# Altium project Shuttler_AFE.PrjPCB (part 2 of 2)

## Sheet AFE_ADC.SchDoc: Shuttler AFE
size A4; Author: G.Kasprowicz; CompanyName: WUT ISE; DrawnBy: G.Kasprowicz; Organization: WUT ISE; Address1: PW ISE; Address2: Nowowiejska 15/19 00-665 Warsaw; Address3: gkasprow@gmail.com; DocumentNumber: 2; Revision: 1.2; SheetNumber: 2; SheetTotal: 6; ModifiedBy: -; CheckedDate: -; Title2: ADC; DivGrp: WUT ISE; Designer: G.Kasprowicz; ModifiedDate: -; ProjectName: Sensor Box
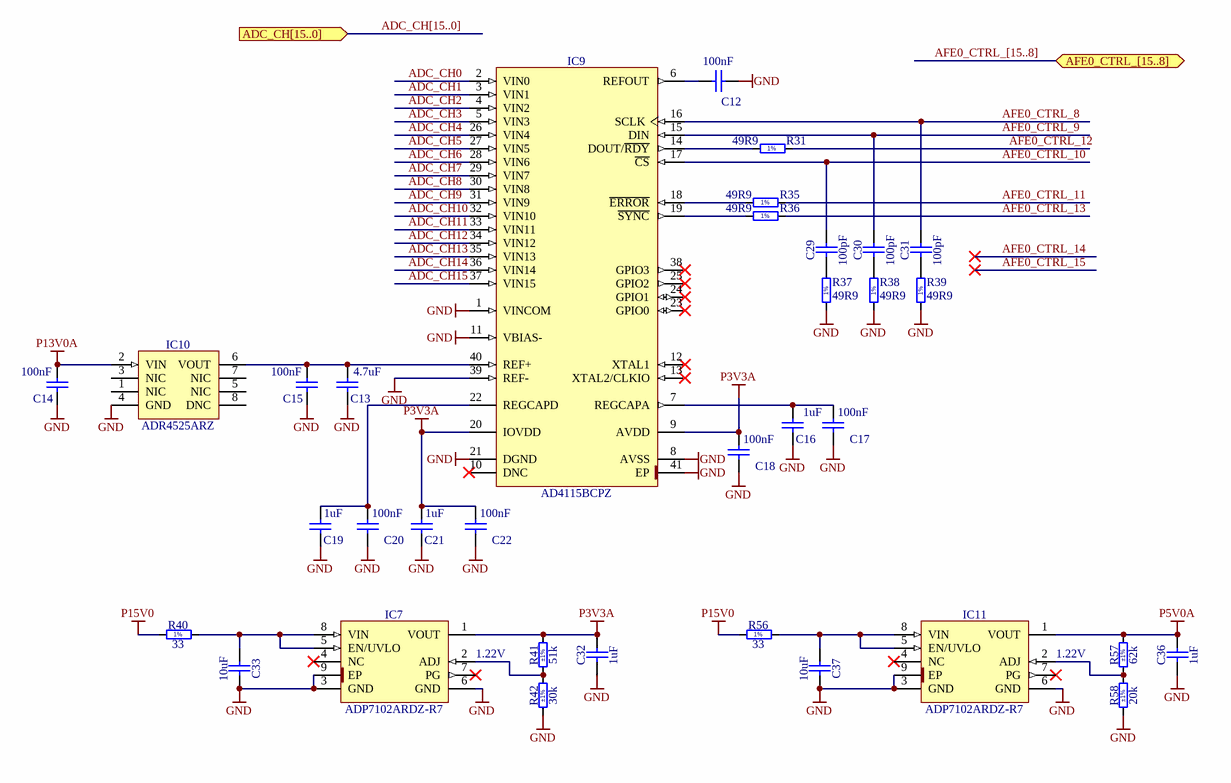
[diagram p4: AFE_ADC.SchDoc]

### Parts
(Parts that share a designator on the sheet are numbered #1, #2 ... from top to bottom, then left to right.)
C12  100nF  [CAPC1005X55N]
C13  4.7uF  [CAPC1608X90N]
C14  100nF  [CAPC1005X55N]
C15  100nF  [CAPC1005X55N]
C16  1uF  [CAPC1608X87N]
C17  100nF  [CAPC1005X55N]
C18  100nF  [CAPC1005X55N]
C19  1uF  [CAPC1608X87N]
C20  100nF  [CAPC1005X55N]
C21  1uF  [CAPC1608X87N]
C22  100nF  [CAPC1005X55N]
C29  100pF  [CAPC1005X55N]
C30  100pF  [CAPC1005X55N]
C31  100pF  [CAPC1005X55N]
C32  1uF  [CAPC1608X87N]
C33  10uF  [CAPC2012X135N]
C36  1uF  [CAPC1608X87N]
C37  10uF  [CAPC2012X135N]
IC7#2  ADP7102ARDZ-R7  [SOIC127P600X175-9N-R241X309]
IC9  AD4115BCPZ  [QFN50P600X600X100-41N-S470]
IC10  ADR4525ARZ  [SOIC127P600X175-8N]
IC11  ADP7102ARDZ-R7  [SOIC127P600X175-9N-R241X309]
R31#2  49R9  [RESC1005X40N]
R35  49R9  [RESC1005X40N]
R36  49R9  [RESC1005X40N]
R37  49R9  [RESC1005X40N]
R38  49R9  [RESC1005X40N]
R39  49R9  [RESC1005X40N]
R40  33  [RESC1005X40N]
R41  51k  Tolerance: ±1%  [RESC1005X40N]
R42  30k  Tolerance: ±1%  [RESC1005X40N]
R56  33  [RESC1005X40N]
R57  62k  Tolerance: ±1%  [RESC1005X40N]
R58  20k  Tolerance: ±1%  [RESC1005X40N]

### Ports
ADC_CH[15..0] (in), AFE0_CTRL_[15..8] (bidir)

### Nets
GND: C12.2 C13.1 C14.2 C15.2 C16.1 C17.2 C18.2 C19.1 C20.2 C21.1 C22.2 C32.1 C33.2 C36.1 C37.2 IC7#2.3(GND) IC7#2.6(GND) IC7#2.9(EP) IC9.1(VINCOM) IC9.8(AVSS) IC9.11(VBIAS-) IC9.21(DGND) IC9.39(REF-) IC9.41(EP) IC10.4(GND) IC11.3(GND) IC11.6(GND) IC11.9(EP) R37.1 R38.1 R39.1 R42.1 R58.1
P3V3A: C18.1 C21.2 C22.1 C32.2 IC7#2.1(VOUT) IC9.9(AVDD) IC9.20(IOVDD) R41.2
P5V0A: C36.2 IC11.1(VOUT) R57.2
P13V0A: C14.1 IC10.2(VIN)
P15V0: R40.1 R56.1
ADC_CH0: IC9.2(VIN0)
ADC_CH1: IC9.3(VIN1)
ADC_CH2: IC9.4(VIN2)
ADC_CH3: IC9.5(VIN3)
ADC_CH4: IC9.26(VIN4)
ADC_CH5: IC9.27(VIN5)
ADC_CH6: IC9.28(VIN6)
ADC_CH7: IC9.29(VIN7)
ADC_CH8: IC9.30(VIN8)
ADC_CH9: IC9.31(VIN9)
ADC_CH10: IC9.32(VIN10)
ADC_CH11: IC9.33(VIN11)
ADC_CH12: IC9.34(VIN12)
ADC_CH13: IC9.35(VIN13)
ADC_CH14: IC9.36(VIN14)
ADC_CH15: IC9.37(VIN15)
AFE0_CTRL_8: C31.2 IC9.16(SCLK)
AFE0_CTRL_9: C30.2 IC9.15(DIN)
AFE0_CTRL_10: C29.2 IC9.17(~{CS})
AFE0_CTRL_11: R35.2
AFE0_CTRL_12: R31#2.2
AFE0_CTRL_13: R36.2
NetC12_1: C12.1 IC9.6(REFOUT)
NetC13_2: C13.2 C15.1 IC9.40(REF+) IC10.6(VOUT)
NetC16_2: C16.2 C17.1 IC9.7(REGCAPA)
NetC19_2: C19.2 C20.1 IC9.22(REGCAPD)
NetC29_1: C29.1 R37.2
NetC30_1: C30.1 R38.2
NetC31_1: C31.1 R39.2
NetC33_1: C33.1 IC7#2.5(EN/UVLO) IC7#2.8(VIN) R40.2
NetC37_1: C37.1 IC11.5(EN/UVLO) IC11.8(VIN) R56.2
NetIC7#2_2: IC7#2.2(ADJ) R41.1 R42.2
NetIC9_14: IC9.14(DOUT/~{RDY}) R31#2.1
NetIC9_18: IC9.18(~{ERROR}) R35.1
NetIC9_19: IC9.19(~{SYNC}) R36.1
NetIC11_2: IC11.2(ADJ) R57.1 R58.2

Not connected (* = marked no-connect by the designer): IC7#2 4(NC)* 7(PG)*; IC9 10(DNC)* 12(XTAL1)* 13(XTAL2/CLKIO)* 23(GPIO0)* 24(GPIO1)* 25(GPIO2)* 38(GPIO3)*; IC10 1(NIC) 3(NIC) 5(NIC) 7(NIC) 8(DNC); IC11 4(NC)* 7(PG)*

### Buses and harness runs
bus ADC_CH[15..0] = port ADC_CH[15..0]
bus AFE0_CTRL_[15..8] = port AFE0_CTRL_[15..8]

### Notes on the sheet
- 1.22V
- Project/Equipment
- Document
- Designer
- Drawn by
- Check.by
- Copyright WUT ISE 2020.
  This documentation describes Open Hardware and is licensed under the CERN OHL v.1.2. You may redistribute and modify this documentation under the terms of the CERN OHL v.1.2. (http://ohwr.org/CERNOHL). This documentation is distributed WITHOUT ANY EXPRESS OR IMPLIED WARRANTY, INCLUDING OF MERCHANTABILITY, SATISFACTORY QUALITY AND FITNESS FOR A PARTICULAR PURPOSE. Please see the CERN OHL v.1.2 for applicable conditions.
- Contact
- File
- Last Mod.
- Print Date
- Sheet
- Size
- A3
- of
- Rev
- (in symbol R0402_33R_1%_0.0625W_100PPM) 1%
- (in symbol R0402_49R9_1%_0.0625W_100PPM) 1%

### Library data of the parts
C12 C14 C15 C17 C18 C20 C22 = CC0402_100NF_16V_10%_X5R: Non-polarised capacitor; Part Description: SMD Multilayer Chip Ceramic Capacitor; Manufacturer: GENERIC; Manufacturer1 Part Number: GRM155R61C104KA88D; Voltage: 16V; TC: X5R; Tolerance: ±10%; Part Number: CC0402_100NF_16V_10%_X5R; Component Kind: Standard; Component Type: Standard; Pin Count: 2; Value: 100nF; Status: None; Manufacturer Part Number: CC0402_100NF_16V_10%_X5R; Case: 0402; Mounted: Yes; Socket: No; SMD: Yes; Sense: No; Manufacturer1 Example: MURATA; Manufacturer1 ComponentHeight: 0.55mm; HelpURL: \\cern.ch\dfs\Applications\Altium\Datasheets\CC0402_X5R_MURATA_GRM.pdf; Author: CERN DEM JLC; CreateDate: 10.12.2013; LatestRevisionDate: 10.12.2013
C13 = CC0603_4.7UF_25V_10%_X5R: Non-polarised capacitor; Part Description: SMD Multilayer Chip Ceramic Capacitor; Manufacturer: GENERIC; Manufacturer1 Part Number: GRM188R61E475KE11D; Voltage: 25V; TC: X5R; Tolerance: ±10%; Part Number: CC0603_4.7UF_25V_10%_X5R; Component Kind: Standard; Component Type: Standard; Pin Count: 2; Value: 4.7uF; Status: None; Manufacturer Part Number: CC0603_4.7UF_25V_10%_X5R; Case: 0603; Mounted: Yes; Socket: No; SMD: Yes; Sense: No; Manufacturer1 Example: MURATA; Manufacturer1 ComponentHeight: 0.95mm; HelpURL: \\cern.ch\dfs\Applications\Altium\Datasheets\CC0603_MURATA_GRM188R61E475KE11D.pdf; Author: CERN DEM JLC; CreateDate: 10.11.2014; LatestRevisionDate: 10.11.2014
C16 C19 C21 = CC0603_1UF_16V_10%_X7R: Non-polarised capacitor; Part Description: SMD Multilayer Chip Ceramic Capacitor; Manufacturer: GENERIC; Manufacturer1 Part Number: 223878615663; Voltage: 16V; TC: X7R; Tolerance: ±10%; Part Number: CC0603_1UF_16V_10%_X7R; Component Kind: Standard; Component Type: Standard; Pin Count: 2; Value: 1uF; Status: None; Manufacturer Part Number: CC0603_1UF_16V_10%_X7R; Case: 0603; Mounted: Yes; Socket: No; SMD: Yes; Sense: No; Manufacturer1 Example: YAGEO PHYCOMP; Manufacturer1 ComponentHeight: 0.9mm; HelpURL: \\cern.ch\dfs\Applications\Altium\Datasheets\CC0603_X7R_PHYCOMP.pdf; Author: CERN DEM JLC; CreateDate: 03.12.2007; LatestRevisionDate: 17.04.2015
C29-C31 = CC0402_100PF_50V_5%_C0G: Non-polarised capacitor; Part Description: SMD Multilayer Chip Ceramic Capacitor; Manufacturer: GENERIC; Manufacturer1 Part Number: C0402C101J5GACTU; Voltage: 50V; TC: C0G/NP0; Tolerance: ±5%; Part Number: CC0402_100PF_50V_5%_C0G; Component Kind: Standard; Component Type: Standard; Pin Count: 2; Value: 100pF; Status: Preferred; Manufacturer Part Number: CC0402_100PF_50V_5%_C0G; Case: 0402; Mounted: Yes; Socket: No; SMD: Yes; Sense: No; Manufacturer1 Example: KEMET; Manufacturer1 ComponentHeight: 0.55mm; HelpURL: \\cern.ch\dfs\Applications\Altium\Datasheets\CC0402_C0G_KEMET_(Commercial Grade).pdf; Author: CERN DEM JLC; CreateDate: 03.12.2007; LatestRevisionDate: 22.04.2015
C32 C36 = CC0603_1UF_25V_10%_X7R: Non-polarised capacitor; Part Description: SMD Multilayer Chip Ceramic Capacitor; Manufacturer: GENERIC; Manufacturer1 Part Number: GRM188R71E105KA12D; Voltage: 25V; TC: X7R; Tolerance: ±10%; Part Number: CC0603_1UF_25V_10%_X7R; Component Kind: Standard; Component Type: Standard; Pin Count: 2; Value: 1uF; Status: None; Manufacturer Part Number: CC0603_1UF_25V_10%_X7R; Case: 0603; Mounted: Yes; Socket: No; SMD: Yes; Sense: No; Manufacturer1 Example: MURATA; Manufacturer1 ComponentHeight: 0.9mm; HelpURL: \\cern.ch\dfs\Applications\Altium\Datasheets\CC0603_X7R_MURATA.pdf; Author: CERN DEM JLC; CreateDate: 18/01/2011; LatestRevisionDate: 18/01/2011
C33 C37 = CC0805_10UF_16V_10%_X5R: Non-polarised capacitor; Part Description: SMD Multilayer Chip Ceramic Capacitor; Manufacturer: GENERIC; Manufacturer1 Part Number: C0805C106K4PAC; Voltage: 16V; TC: X5R; Tolerance: ±10%; Part Number: CC0805_10UF_16V_10%_X5R; Component Kind: Standard; Component Type: Standard; Pin Count: 2; Value: 10uF; Status: Preferred; Manufacturer Part Number: CC0805_10UF_16V_10%_X5R; Case: 0805; Mounted: Yes; Socket: No; SMD: Yes; Manufacturer1 Example: KEMET; Manufacturer1 ComponentHeight: 1.4mm; HelpURL: \\cern.ch\dfs\Applications\Altium\Datasheets\CC1206_X5R_KEMET.pdf; Author: CERN DEM JLC; CreateDate: 03.12.2007; LatestRevisionDate: 03.12.2007; Sense: No
IC7#2 IC11 = ADP7102ARDZ-R7: 1.22V to 19V, 300mA, Low Noise, CMOS LDO Adjustable Linear Regulator; Manufacturer: ANALOG DEVICES; PressFit: No; Bonding: No; Part Number: ADP7102ARDZ-R7; Component Kind: Standard; Component Type: Standard; Device: ADP7102ARDZ-R7; PackageDescription: SOIC 8, Pitch 1.27mm - Body 3.9x4.9mm, (w/thermal tab 2.41mm X 3.098mm), IPC Medium Density; Part Description: 1.22V to 19V, 300mA, Low Noise, CMOS LDO Adjustable Linear Regulator; Manufacturer Part Number: ADP7102ARDZ-R7; Pin Count: 8; Case: SOIC8; Mounted: Yes; Socket: No; SMD: Yes; Sense: No; ComponentHeight: 1.75mm; HelpURL: \\cern.ch\dfs\Applications\Altium\Datasheets\ADP7102ARDZ-R7.pdf; Author: CERN DEM JLC; CreateDate: 16.06.2014; LatestRevisionDate: 16.06.2014
IC9 = AD4115BCPZ: Single-Supply, Multichannel, 125kSPS, 24-Bit, Sigma-Delta ADC with ±10V Inputs; Manufacturer: ANALOG DEVICES; PressFit: No; Bonding: No; Part Number: AD4115BCPZ; Component Kind: Standard; Component Type: Standard; Device: AD4115BCPZ; PackageDescription: QFN, 0.50mm Pitch, Square; 40 Pin, 6.00mm L X 6.00mm W X 1.00mm H body (w/Thermal Tab 4.70 x 4.70mm), IPC Medium Density; Part Description: Single-Supply, Multichannel, 125kSPS, 24-Bit, Sigma-Delta ADC with ±10V Inputs; Manufacturer Part Number: AD4115BCPZ; Pin Count: 41; Case: QFN40; Mounted: Yes; Socket: No; SMD: Yes; Sense: No; ComponentHeight: 1.0mm; Author: CERN DEM BC; HelpURL: \\cern.ch\dfs\Applications\Altium\Datasheets\AD4115BCPZ.pdf; CreateDate: 30.10.2020; LatestRevisionDate: 30.10.2020
IC10 = ADR4525ARZ: 2.5V Output, 1mV ±0.04% Accuracy, 4ppm/°C Ultralow Noise, High Accuracy Voltage References; Manufacturer: ANALOG DEVICES; PressFit: No; Bonding: No; Part Number: ADR4525ARZ; Component Kind: Standard; Component Type: Standard; Device: ADR4525ARZ; PackageDescription: SOIC 8, Pitch 1.27mm, Body 4x5mm, IPC Medium Density; Part Description: 2.5V Output, 1mV ±0.04% Accuracy, 4ppm/°C Ultralow Noise, High Accuracy Voltage References; Manufacturer Part Number: ADR4525ARZ; Pin Count: 8; Case: SOIC8; Mounted: Yes; Socket: No; SMD: Yes; Sense: No; ComponentHeight: 1.75mm; HelpURL: \\cern.ch\dfs\Applications\Altium\Datasheets\ADR4525ARZ.pdf; Author: CERN DEM BC; CreateDate: 19.06.2020; LatestRevisionDate: 19.06.2020
R31#2 R35-R39 = R0402_49R9_1%_0.0625W_100PPM: Resistor - 1%; Part Description: General Purpose Thick Film Chip Resistor; Manufacturer: GENERIC; Manufacturer1 Part Number: 232270674999L or RC0402FR-0749R9L; TC: ±100ppm/°C; PressFit: No; Part Number: R0402_49R9_1%_0.0625W_100PPM; Component Kind: Standard; Component Type: Standard; Pin Count: 2; Value: 49R9; Status: Not Recommended; Power: 0.0625W; Tolerance: ±1%; Manufacturer Part Number: R0402_49R9_1%_0.0625W_100PPM; Case: 0402; Mounted: Yes; Sense: No; Socket: No; SMD: Yes; Manufacturer1 Example: YAGEO PHYCOMP; Manufacturer1 ComponentHeight: 0.4mm; HelpURL: \\cern.ch\dfs\Applications\Altium\Datasheets\R0402_Phycomp_RC0402.pdf; Author: CERN DEM JLC; CreateDate: 24.10.2012; LatestRevisionDate: 24.10.2012
R40 R56 = R0402_33R_1%_0.0625W_100PPM: Resistor - 1%; Part Description: General Purpose Thick Film Chip Resistor; Manufacturer: GENERIC; Manufacturer1 Part Number: 232270673309L; TC: ±100ppm/°C; PressFit: No; Part Number: R0402_33R_1%_0.0625W_100PPM; Component Kind: Standard; Component Type: Standard; Pin Count: 2; Value: 33; Status: Not Recommended; Power: 0.0625W; Tolerance: ±1%; Manufacturer Part Number: R0402_33R_1%_0.0625W_100PPM; Case: 0402; Mounted: Yes; Sense: No; Socket: No; SMD: Yes; Manufacturer1 Example: YAGEO PHYCOMP; Manufacturer1 ComponentHeight: 0.4mm; HelpURL: \\cern.ch\dfs\Applications\Altium\Datasheets\R0402_Phycomp_RC0402.pdf; Author: CERN DEM JLC; CreateDate: 03/12/2007; LatestRevisionDate: 17/10/2012
R41 = R0402_51K_1%_0.0625W_100PPM: Resistor - 1%; Part Description: General Purpose Thick Film Chip Resistor; Manufacturer: GENERIC; Manufacturer1 Part Number: 232270674703L; TC: ±100ppm/°C; PressFit: No; Part Number: R0402_51K_1%_0.0625W_100PPM; Component Kind: Standard; Component Type: Standard; Pin Count: 2; Value: 51k; Status: Not Recommended; Power: 0.0625W; Manufacturer Part Number: R0402_51K_1%_0.0625W_100PPM; Case: 0402; Mounted: Yes; Sense: No; Socket: No; SMD: Yes; Manufacturer1 Example: YAGEO PHYCOMP; Manufacturer1 ComponentHeight: 0.4mm; HelpURL: \\cern.ch\dfs\Applications\Altium\Datasheets\R0402_Phycomp_RC0402.pdf; Author: CERN DEM JLC; CreateDate: 03.12.2007; LatestRevisionDate: 17.10.2012
R42 = R0402_30K_1%_0.0625W_100PPM: Resistor - 1%; Part Description: General Purpose Thick Film Chip Resistor; Manufacturer: GENERIC; Manufacturer1 Part Number: 232270673003L; TC: ±100ppm/°C; PressFit: No; Part Number: R0402_30K_1%_0.0625W_100PPM; Component Kind: Standard; Component Type: Standard; Pin Count: 2; Value: 30k; Status: Not Recommended; Power: 0.0625W; Manufacturer Part Number: R0402_30K_1%_0.0625W_100PPM; Case: 0402; Mounted: Yes; Sense: No; Socket: No; SMD: Yes; Manufacturer1 Example: YAGEO PHYCOMP; Manufacturer1 ComponentHeight: 0.4mm; HelpURL: \\cern.ch\dfs\Applications\Altium\Datasheets\R0402_Phycomp_RC0402.pdf; Author: CERN DEM JLC; CreateDate: 03.12.2007; LatestRevisionDate: 17.10.2012
R57 = R0402_62K_1%_0.0625W_100PPM: Resistor - 1%; Part Description: General Purpose Thick Film Chip Resistor; Manufacturer: GENERIC; Manufacturer1 Part Number: 232270676203L; TC: ±100ppm/°C; PressFit: No; Part Number: R0402_62K_1%_0.0625W_100PPM; Component Kind: Standard; Component Type: Standard; Pin Count: 2; Value: 62k; Status: Not Recommended; Power: 0.0625W; Manufacturer Part Number: R0402_62K_1%_0.0625W_100PPM; Case: 0402; Mounted: Yes; Sense: No; Socket: No; SMD: Yes; Manufacturer1 Example: YAGEO PHYCOMP; Manufacturer1 ComponentHeight: 0.4mm; HelpURL: \\cern.ch\dfs\Applications\Altium\Datasheets\R0402_Phycomp_RC0402.pdf; Author: CERN DEM JLC; CreateDate: 03.12.2007; LatestRevisionDate: 17.10.2012
R58 = R0402_20K_1%_0.0625W_100PPM: Resistor - 1%; Part Description: General Purpose Thick Film Chip Resistor; Manufacturer: GENERIC; Manufacturer1 Part Number: 232270672003L; TC: ±100ppm/°C; PressFit: No; Part Number: R0402_20K_1%_0.0625W_100PPM; Component Kind: Standard; Component Type: Standard; Pin Count: 2; Value: 20k; Status: Not Recommended; Power: 0.0625W; Manufacturer Part Number: R0402_20K_1%_0.0625W_100PPM; Case: 0402; Mounted: Yes; Sense: No; Socket: No; SMD: Yes; Manufacturer1 Example: YAGEO PHYCOMP; Manufacturer1 ComponentHeight: 0.4mm; HelpURL: \\cern.ch\dfs\Applications\Altium\Datasheets\R0402_Phycomp_RC0402.pdf; Author: CERN DEM JLC; CreateDate: 03.12.2007; LatestRevisionDate: 17.10.2012

## Sheet AFE_Supply.SchDoc: Shuttler AFE
size A4; Author: G.Kasprowicz; CompanyName: WUT ISE; DrawnBy: G.Kasprowicz; Organization: WUT ISE; Address1: PW ISE; Address2: Nowowiejska 15/19 00-665 Warsaw; Address3: gkasprow@gmail.com; DocumentNumber: 4; Revision: 1.2; SheetNumber: 4; SheetTotal: 6; ModifiedBy: -; CheckedDate: -; Title2: Power supply; DivGrp: WUT ISE; Designer: G.Kasprowicz; ModifiedDate: -; ProjectName: Sensor Box
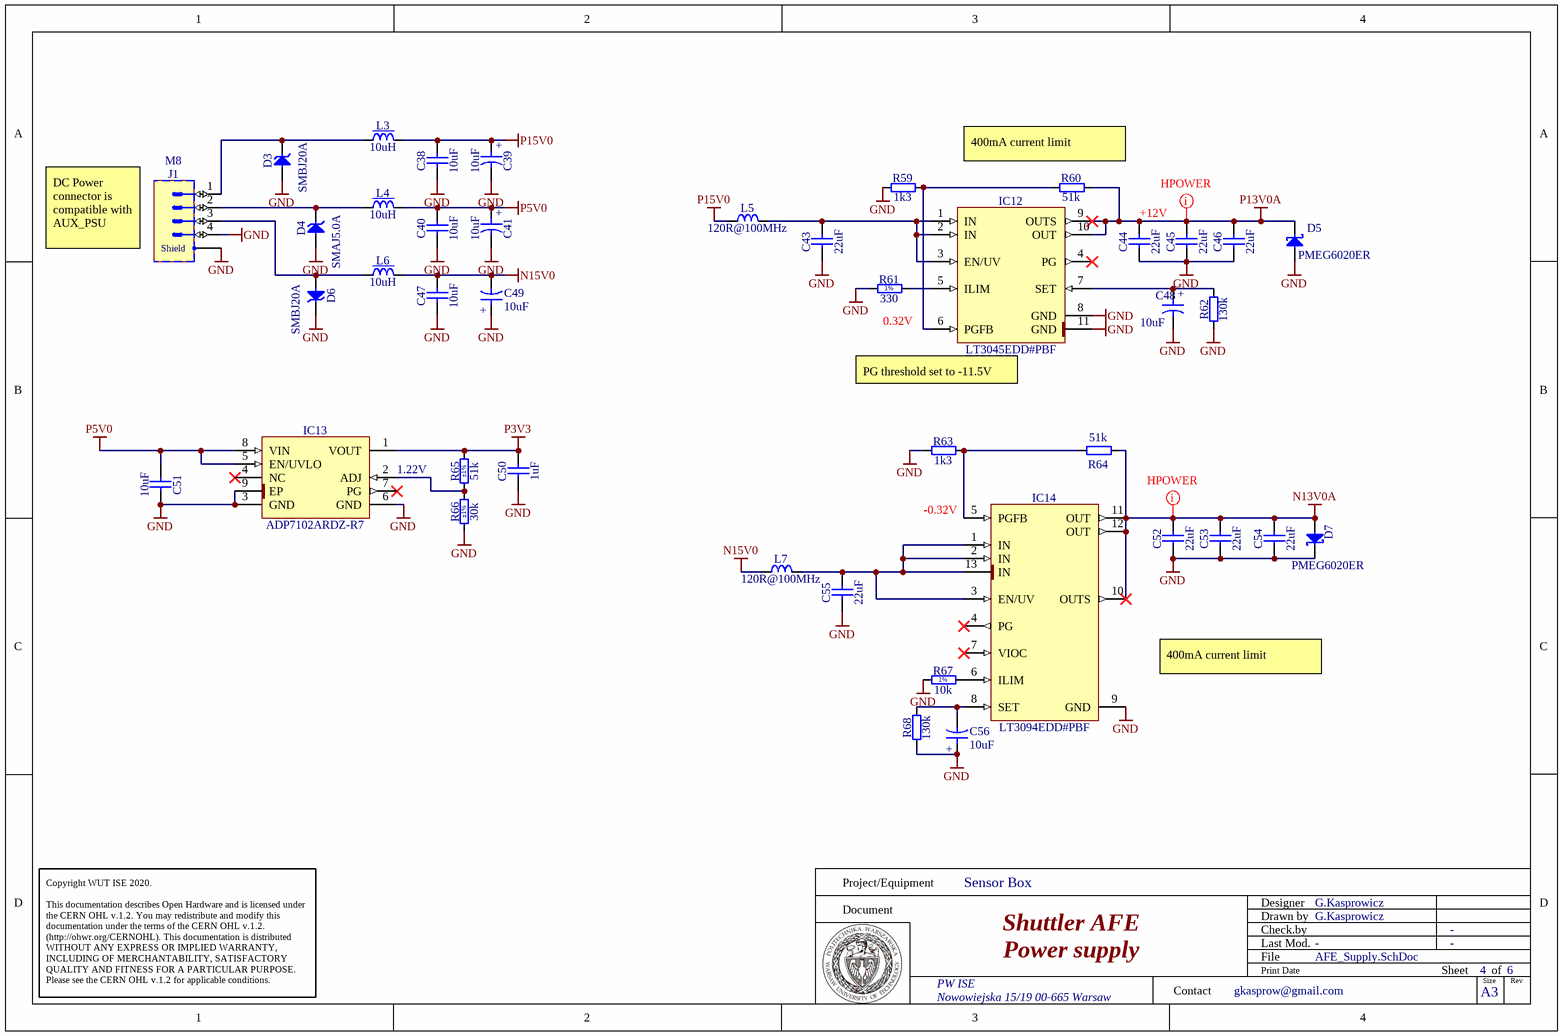
[diagram p5: AFE_Supply.SchDoc]

### Parts
C38  10uF  [CAPC2012X95N]
C39  10uF  [CAPMP3216X180N]
C40  10uF  [CAPC2012X95N]
C41  10uF  [CAPMP3216X180N]
C43  22uF  [CAPC2012X135N]
C44  22uF  [CAPC2012X135N]
C45  22uF  [CAPC2012X135N]
C46  22uF  [CAPC2012X135N]
C47  10uF  [CAPC2012X95N]
C48  10uF  [CAPMP3216X180N]
C49  10uF  [CAPMP3216X180N]
C50  1uF  [CAPC1608X87N]
C51  10uF  [CAPC2012X135N]
C52  22uF  [CAPC2012X135N]
C53  22uF  [CAPC2012X135N]
C54  22uF  [CAPC2012X135N]
C55  22uF  [CAPC2012X135N]
C56  10uF  [CAPMP3216X180N]
D3  SMBJ20A  [DIOM5336X265N]
D4  SMAJ5.0A  [DIOM5226X262N]
D5  PMEG6020ER  [SODFL3517X110N]
D6  SMBJ20A  [DIOM5336X265N]
D7  PMEG6020ER  [SODFL3517X110N]
IC12  LT3045EDD#PBF  [SON50P300X300X80-11N-R175X248]
IC13  ADP7102ARDZ-R7  [SOIC127P600X175-9N-R241X309]
IC14  LT3094EDD#PBF  [SON45P300X300X80-13N-R175X248]
J1  M8  [AMPHENOL_M8AS-04PMMR-SF8001]
L3  10uH  [IND_MURATA_LQW32FT_0H]
L4  10uH  [IND_MURATA_LQW32FT_0H]
L5  120R@100MHz  [INDC1608X95N]
L6  10uH  [IND_MURATA_LQW32FT_0H]
L7  120R@100MHz  [INDC1608X95N]
R59  1k3  [RESC1005X40N]
R60  51k  [RESC1005X40N]
R61  330  [RESC1005X40N]
R62  130k  [RESC1608X55N]
R63  1k3  [RESC1005X40N]
R64  51k  [RESC1005X40N]
R65  51k  Tolerance: ±1%  [RESC1005X40N]
R66  30k  Tolerance: ±1%  [RESC1005X40N]
R67  10k  [RESC1005X40N]
R68  130k  [RESC1608X55N]

### Nets
GND: C38.1 C39.2 C40.1 C41.2 C43.1 C44.1 C45.1 C46.1 C47.1 C48.2 C49.1 C50.1 C51.2 C52.1 C53.1 C54.1 C55.1 C56.1 D3.2(A) D4.2(A) D5.2(A) D6.1(C) D7.1(C) IC12.8(GND) IC12.11(GND) IC13.3(GND) IC13.6(GND) IC13.9(EP) IC14.9(GND) J1.4 J1.SHIELD R59.1 R61.1 R62.1 R63.1 R66.1 R67.1 R68.1
N13V0A: C52.2 C53.2 C54.2 D7.2(A) IC14.10(OUTS) IC14.11(OUT) IC14.12(OUT) R64.1
N15V0: C47.2 C49.2 L6.2 L7.1
P3V3: C50.2 IC13.1(VOUT) R65.2
P5V0: C40.2 C41.1 C51.1 IC13.5(EN/UVLO) IC13.8(VIN) L4.2
P13V0A: C44.2 C45.2 C46.2 D5.1(C) IC12.9(OUTS) IC12.10(OUT) R60.2
P15V0: C38.2 C39.1 L3.2 L5.1
NetC43_2: C43.2 IC12.1(IN) IC12.2(IN) IC12.3(EN/UV) L5.2
NetC48_1: C48.1 IC12.7(SET) R62.2
NetC55_2: C55.2 IC14.1(IN) IC14.2(IN) IC14.3(EN/UV) IC14.13(IN) L7.2
NetC56_2: C56.2 IC14.8(SET) R68.2
NetD3_1: D3.1(C) J1.1 L3.1
NetD4_1: D4.1(C) J1.2 L4.1
NetD6_2: D6.2(A) J1.3 L6.1
NetIC12_5: IC12.5(ILIM) R61.2
NetIC12_6: IC12.6(PGFB) R59.2 R60.1
NetIC13_2: IC13.2(ADJ) R65.1 R66.2
NetIC14_5: IC14.5(PGFB) R63.2 R64.2
NetIC14_6: IC14.6(ILIM) R67.2

Not connected (* = marked no-connect by the designer): IC12 4(PG)*; IC13 4(NC)* 7(PG)*; IC14 4(PG)* 7(VIOC)*

### Layout directives
net class Hpower: N13V0A, P13V0A

### Notes on the sheet
- (near R60) 400mA current limit
- DC Power connector is compatible with AUX_PSU
- (near C44) +12V
- (near IC12) PG threshold set to -11.5V
- 0.32V
- 1.22V
- (near IC14) -0.32V
- 400mA current limit
- Project/Equipment
- Document
- Designer
- Drawn by
- Check.by
- Copyright WUT ISE 2020.
  This documentation describes Open Hardware and is licensed under the CERN OHL v.1.2. You may redistribute and modify this documentation under the terms of the CERN OHL v.1.2. (http://ohwr.org/CERNOHL). This documentation is distributed WITHOUT ANY EXPRESS OR IMPLIED WARRANTY, INCLUDING OF MERCHANTABILITY, SATISFACTORY QUALITY AND FITNESS FOR A PARTICULAR PURPOSE. Please see the CERN OHL v.1.2 for applicable conditions.
- Contact
- File
- Last Mod.
- Print Date
- Sheet
- Size
- A3
- of
- Rev
- (in symbol AMPHENOL_M8AS-04PMMR-SF8001) Shield
- (in symbol CTE3216-18_10UF_16V_20%_AVX_TCJ) +
- (in symbol R0402_10k_1%_0.0625W_100PPM) 1%
- (in symbol R0402_330R_1%_0.0625W_100PPM) 1%

### Library data of the parts
C38 C40 C47 = CC0805_10UF_25V_10%_X5R: Non-polarised capacitor; Part Description: SMD Multilayer Chip Ceramic Capacitor; Manufacturer: GENERIC; Manufacturer1 Part Number: GRM219R61E106KA12D; Voltage: 25V; TC: X5R; Tolerance: ±10%; Part Number: CC0805_10UF_25V_10%_X5R; Component Kind: Standard; Component Type: Standard; Pin Count: 2; Value: 10uF; Status: Preferred; Manufacturer Part Number: CC0805_10UF_25V_10%_X5R; Case: 0805; Mounted: Yes; Socket: No; SMD: Yes; Sense: No; Manufacturer1 Example: MURATA; Manufacturer1 ComponentHeight: 0.95mm; HelpURL: \\cern.ch\dfs\Applications\Altium\Datasheets\CC0805_X5R_MURATA_GRM.pdf; Author: CERN DEM JLC; CreateDate: 25.10.2012; LatestRevisionDate: 06.09.2016
C39 C41 C48 C49 C56 = CTE3216-18_10UF_16V_20%_AVX_TCJ: Polarised capacitor; Part Description: ESR 0R200 Tantalum Solid Electrolytic Chip Capacitor with Conductive Polymer Electrode; Manufacturer: AVX; Manufacturer Part Number: TCJA106M016R0200 or  or TR3A106K016C1700; Voltage: 16V; Tolerance: ±20%; Part Number: CTE3216-18_10UF_16V_20%_AVX_TCJ; Component Kind: Standard; Component Type: Standard; Pin Count: 2; Value: 10uF; Status: Preferred; Case: A; Mounted: Yes; Socket: No; SMD: Yes; Sense: No; ComponentHeight: 1.8mm; HelpURL: \\cern.ch\dfs\Applications\Altium\Datasheets\CTE_AVX_TCJ.pdf; Author: CERN DEM JLC; CreateDate: 29.03.2012; LatestRevisionDate: 29.03.2012
C43-C46 C52-C55 = CC0805_22UF_16V_10%_X5R: Non-polarised capacitor; Part Description: SMD Multilayer Chip Ceramic Capacitor; Manufacturer: GENERIC; Manufacturer1 Part Number: C2012X5R1C226KT; Voltage: 16V; TC: X5R; Tolerance: ±10%; Part Number: CC0805_22UF_16V_10%_X5R; Component Kind: Standard; Component Type: Standard; Pin Count: 2; Value: 22uF; Status: Preferred; Manufacturer Part Number: CC0805_22UF_16V_10%_X5R; Case: 0805; Mounted: Yes; Socket: No; SMD: Yes; Sense: No; Manufacturer1 Example: TDK; Manufacturer1 ComponentHeight: 1.35mm; HelpURL: \\cern.ch\dfs\Applications\Altium\Datasheets\CC0805_X5R_TDK_C.pdf; Author: CERN DEM JLC; CreateDate: 25.10.2012; LatestRevisionDate: 25.10.2012
C50 = CC0603_1UF_25V_10%_X7R: as C32 on sheet AFE_ADC; Part Number: CC0603_1UF_25V_10%_X7R; Component Kind: Standard; Component Type: Standard; Pin Count: 2; Value: 1uF; Status: None; Manufacturer Part Number: CC0603_1UF_25V_10%_X7R; Case: 0603; Mounted: Yes; Socket: No; SMD: Yes; Sense: No; Manufacturer1 Example: MURATA; Manufacturer1 ComponentHeight: 0.9mm; HelpURL: \\cern.ch\dfs\Applications\Altium\Datasheets\CC0603_X7R_MURATA.pdf; Author: CERN DEM JLC; CreateDate: 18/01/2011; LatestRevisionDate: 18/01/2011
C51 = CC0805_10UF_16V_10%_X5R: as C33 on sheet AFE_ADC; Part Number: CC0805_10UF_16V_10%_X5R; Component Kind: Standard; Component Type: Standard; Pin Count: 2; Value: 10uF; Status: Preferred; Manufacturer Part Number: CC0805_10UF_16V_10%_X5R; Case: 0805; Mounted: Yes; Socket: No; SMD: Yes; Manufacturer1 Example: KEMET; Manufacturer1 ComponentHeight: 1.4mm; HelpURL: \\cern.ch\dfs\Applications\Altium\Datasheets\CC1206_X5R_KEMET.pdf; Author: CERN DEM JLC; CreateDate: 03.12.2007; LatestRevisionDate: 03.12.2007; Sense: No
D3 D6 = SMBJ20A: Transient Voltage Suppressor Diode (Uni-Directional); Part Description: Uni-Directional Transient Voltage Suppressor Diode; Manufacturer: FAIRCHILD SEMICONDUCTOR; Voltage: 20V; Power: 600W; PressFit: No; Bonding: No; Part Number: SMBJ20A; Component Kind: Standard; Component Type: Standard; Device: SMBJ20A; PackageDescription: DO-214-AA/SMB Diode, Molded Body; 5.34mm L X 3.625mm W X 2.65mm H, IPC Medium Density; Manufacturer Part Number: SMBJ20A; Pin Count: 2; Case: DO-214AA; Mounted: Yes; Socket: No; SMD: Yes; Sense: No; ComponentHeight: 2.65mm; HelpURL: \\cern.ch\dfs\Applications\Altium\Datasheets\SMBJ.pdf; Author: CERN DEM JLC; CreateDate: 12.05.2009; LatestRevisionDate: 19.12.2011
D4 = SMAJ5.0A: Transient Voltage Suppressor Diode (Uni-Directional); Part Description: Surface Mount Uni-directional Transient Voltage Suppressor Diode; Manufacturer: BOURNS; Voltage: 5V; Power: 400W; PressFit: No; Bonding: No; Part Number: SMAJ5.0A; Component Kind: Standard; Component Type: Standard; Device: SMAJ5.0A; PackageDescription: DO-214-AC/SMA Diode, Molded Body; 5.21mm L X 2.605mm W X 2.62mm H, IPC Medium Density; Manufacturer Part Number: SMAJ5.0A; Pin Count: 2; Case: DO-214AC; Mounted: Yes; Socket: No; SMD: Yes; Sense: No; ComponentHeight: 2.62mm; HelpURL: \\cern.ch\dfs\Applications\Altium\Datasheets\SMAJ5.0A.pdf; Author: CERN DEM MR; CreateDate: 14.07.2016; LatestRevisionDate: 14.07.2016
D5 D7 = PMEG6020ER: Schottky Diode; Part Description: MEGA Schottky Barrier Rectifier; Manufacturer: NXP SEMICONDUCTORS; Voltage: 60V; Power: 2A; PressFit: No; Bonding: No; Part Number: PMEG6020ER; Component Kind: Standard; Component Type: Standard; Device: PMEG6020ER; PackageDescription: SODFL Diode (SOD123W); 2.60mm W X 1.70mm L X 1.10mm H body, IPC Medium Density; Manufacturer Part Number: PMEG6020ER; Pin Count: 2; Case: SOD123; Mounted: Yes; Socket: No; SMD: Yes; Sense: No; ComponentHeight: 0.65mm; HelpURL: \\cern.ch\dfs\Applications\Altium\Datasheets\PMEG6020ER.pdf; Author: CERN DEM JMW; CreateDate: 19.06.2014; LatestRevisionDate: 19.06.2014
IC12 = LT3045EDD#PBF: 20V, 500mA, Ultralow Noise, Ultrahigh PSRR Linear Regulator; Manufacturer: LINEAR TECHNOLOGY; PressFit: No; Bonding: No; Part Number: LT3045EDD#PBF; Component Kind: Standard; Component Type: Standard; Device: LT3045EDD#PBF; PackageDescription: SON, 0.50mm Pitch; 10-pin, 3.00mm W  X 3.00mm L X 0.80mm H Body, (w/thermal tab 1.75 X 2.48 mm), IPC Medium Density; Part Description: 20V, 500mA, Ultralow Noise, Ultrahigh PSRR Linear Regulator; Manufacturer Part Number: LT3045EDD#PBF; Pin Count: 11; Case: SON10; Mounted: Yes; Socket: No; SMD: Yes; Sense: No; ComponentHeight: 0.8mm; HelpURL: \\cern.ch\dfs\Applications\Altium\Datasheets\LT3045EDD#PBF.pdf; Author: CERN DEM JLC; CreateDate: 07.12.2016; LatestRevisionDate: 07.12.2016
IC13 = ADP7102ARDZ-R7: as IC7#2 on sheet AFE_ADC; Part Number: ADP7102ARDZ-R7; Component Kind: Standard; Component Type: Standard; Device: ADP7102ARDZ-R7; PackageDescription: SOIC 8, Pitch 1.27mm - Body 3.9x4.9mm, (w/thermal tab 2.41mm X 3.098mm), IPC Medium Density; Part Description: 1.22V to 19V, 300mA, Low Noise, CMOS LDO Adjustable Linear Regulator; Manufacturer Part Number: ADP7102ARDZ-R7; Pin Count: 8; Case: SOIC8; Mounted: Yes; Socket: No; SMD: Yes; Sense: No; ComponentHeight: 1.75mm; HelpURL: \\cern.ch\dfs\Applications\Altium\Datasheets\ADP7102ARDZ-R7.pdf; Author: CERN DEM JLC; CreateDate: 16.06.2014; LatestRevisionDate: 16.06.2014
IC14 = LT3094EDD#PBF: -20V, 500mA, Ultralow Noise, Ultrahigh PSRR Negative Linear Regulator; Manufacturer: LINEAR TECHNOLOGY; PressFit: No; Bonding: No; Part Number: LT3094EDD#PBF; Component Kind: Standard; Component Type: Standard; Device: LT3094EDD#PBF; PackageDescription: SON, 0.45mm Pitch; 12 Pin, 3.00mm W X 3.00mm L X 0.80mm H Body (w/Thermal tab 1.75 x 2.48mm), IPC Medium Density; Part Description: -20V, 500mA, Ultralow Noise, Ultrahigh PSRR Negative Linear Regulator; Manufacturer Part Number: LT3094EDD#PBF; Pin Count: 13; Case: SON12; Mounted: Yes; Socket: No; SMD: Yes; Sense: No; ComponentHeight: 0.8mm; HelpURL: \\cern.ch\dfs\Applications\Altium\Datasheets\LT3094EDD#PBF.pdf; Author: CERN DEM JLC; CreateDate: 12.11.2018; LatestRevisionDate: 12.11.2018
J1 = AMPHENOL_M8AS-04PMMR-SF8001: Connector 4 Male + Shield; Part Description: 4 Contacts,  IP68 Sealing Level, Right Angled M8 Circular Header; PressFit: No; Part Number: AMPHENOL_M8AS-04PMMR-SF8001; Component Kind: Standard; Component Type: Standard; Pin Count: 6; Family: M8; Mounted: Yes; Socket: No; SMD: No; Sense: No; Status: None; Manufacturer: AMPHENOL; Manufacturer Part Number: M8AS-04PMMR-SF8001; ComponentHeight: 12.65mm; HelpURL: \\cern.ch\dfs\Applications\Altium\Datasheets\AMPHENOL_M8AS-04PMMR-SF8001.pdf; Author: CERN DEM MR; CreateDate: 08.04.2019; LatestRevisionDate: 08.04.2019
L3 L4 L6 = IND1210_10UH_20%_MURATA_LQW32FT100M0H: Inductor With Core; Part Description: Wide Frequency Band, High Inductance, For Power Line; Manufacturer: MURATA; Power: 500mA; Resistance: 0R4; Tolerance: ±20%; Part Number: IND1210_10UH_20%_MURATA_LQW32FT100M0H; Component Kind: Standard; Component Type: Standard; Pin Count: 2; Value: 10uH; Status: None; Manufacturer Part Number: LQW32FT100M0H; Case: 1210; Mounted: Yes; Socket: No; SMD: Yes; Sense: No; ComponentHeight: 2.5mm; HelpURL: \\cern.ch\dfs\Applications\Altium\Datasheets\IND_MURATA_LQW32FT100M0H.pdf; Author: CERN DEM BC; CreateDate: 18.05.2020; LatestRevisionDate: 18.05.2020
L5 L7 = IND0603_MURATA_BLM18PG121SN1D: Inductor; Part Description: SMD EMIFIL Chip Ferrite Bead; Manufacturer: MURATA; Power: 2A; Resistance: 0.05R; Part Number: IND0603_MURATA_BLM18PG121SN1D; Component Kind: Standard; Component Type: Standard; Pin Count: 2; Value: 120R@100MHz; Status: None; Manufacturer Part Number: BLM18PG121SN1D; Case: 0603; Mounted: Yes; Socket: No; SMD: Yes; Sense: No; ComponentHeight: 0.95mm; HelpURL: \\cern.ch\dfs\Applications\Altium\Datasheets\IND0603_MURATA_BLM18P.pdf; Author: CERN DEM BC; CreateDate: 27.07.2015; LatestRevisionDate: 27.07.2015
R59 R63 = R0402_1K3_1%_0.0625W_100PPM: Resistor - 1%; Part Description: General Purpose Thick Film Chip Resistor; Manufacturer: GENERIC; Manufacturer1 Part Number: 232270671302L; TC: ±100ppm/°C; PressFit: No; Part Number: R0402_1K3_1%_0.0625W_100PPM; Component Kind: Standard; Component Type: Standard; Pin Count: 2; Value: 1k3; Status: Not Recommended; Power: 0.0625W; Tolerance: ±1%; Manufacturer Part Number: R0402_1K3_1%_0.0625W_100PPM; Case: 0402; Mounted: Yes; Sense: No; Socket: No; SMD: Yes; Manufacturer1 Example: YAGEO PHYCOMP; Manufacturer1 ComponentHeight: 0.4mm; HelpURL: \\cern.ch\dfs\Applications\Altium\Datasheets\R0402_Phycomp_RC0402.pdf; Author: CERN DEM JLC; CreateDate: 03.12.2007; LatestRevisionDate: 17.10.2012
R60 R64 = R0402_51K_1%_0.0625W_100PPM: Resistor - 1%; Part Description: General Purpose Thick Film Chip Resistor; Manufacturer: GENERIC; Manufacturer1 Part Number: 232270675103L; TC: ±100ppm/°C; PressFit: No; Part Number: R0402_51K_1%_0.0625W_100PPM; Component Kind: Standard; Component Type: Standard; Pin Count: 2; Value: 51k; Status: Not Recommended; Power: 0.0625W; Tolerance: ±1%; Manufacturer Part Number: R0402_51K_1%_0.0625W_100PPM; Case: 0402; Mounted: Yes; Sense: No; Socket: No; SMD: Yes; Manufacturer1 Example: YAGEO PHYCOMP; Manufacturer1 ComponentHeight: 0.4mm; HelpURL: \\cern.ch\dfs\Applications\Altium\Datasheets\R0402_Phycomp_RC0402.pdf; Author: CERN DEM JLC; CreateDate: 03.12.2007; LatestRevisionDate: 17.10.2012
R61 = R0402_330R_1%_0.0625W_100PPM: Resistor - 1%; Part Description: General Purpose Thick Film Chip Resistor; Manufacturer: GENERIC; Manufacturer1 Part Number: 232270673301L; TC: ±100ppm/°C; PressFit: No; Part Number: R0402_330R_1%_0.0625W_100PPM; Component Kind: Standard; Component Type: Standard; Pin Count: 2; Value: 330; Status: Not Recommended; Power: 0.0625W; Tolerance: ±1%; Manufacturer Part Number: R0402_330R_1%_0.0625W_100PPM; Case: 0402; Mounted: Yes; Sense: No; Socket: No; SMD: Yes; Manufacturer1 Example: YAGEO PHYCOMP; Manufacturer1 ComponentHeight: 0.4mm; HelpURL: \\cern.ch\dfs\Applications\Altium\Datasheets\R0402_Phycomp_RC0402.pdf; Author: CERN DEM JLC; CreateDate: 03.12.2007; LatestRevisionDate: 17.10.2012
R62 R68 = R0603_130k_1%_0.1W_100PPM: Resistor - 1%; Part Description: General Purpose Thick Film Chip Resistor; Manufacturer: GENERIC; Manufacturer1 Part Number: NRC06F1303TRF; Power: 0.1W; TC: ±100ppm/°C; PressFit: No; Part Number: R0603_130K_1%_0.1W_100PPM; Component Kind: Standard; Component Type: Standard; Pin Count: 2; Value: 130k; Status: Preferred; Tolerance: ±1%; Manufacturer Part Number: R0603_130K_1%_0.1W_100PPM; Case: 0603; Mounted: Yes; Sense: No; Socket: No; SMD: Yes; Manufacturer1 Example: NIC COMPONENT; Manufacturer1 ComponentHeight: 0.55mm; HelpURL: \\cern.ch\dfs\Applications\Altium\Datasheets\R0603_NIC_NRC.pdf; Author: CERN DEM JLC; CreateDate: 03.12.2007; LatestRevisionDate: 13.03.2008
R65 = R0402_51K_1%_0.0625W_100PPM: as R41 on sheet AFE_ADC; Part Number: R0402_51K_1%_0.0625W_100PPM; Component Kind: Standard; Component Type: Standard; Pin Count: 2; Value: 51k; Status: Not Recommended; Power: 0.0625W; Manufacturer Part Number: R0402_51K_1%_0.0625W_100PPM; Case: 0402; Mounted: Yes; Sense: No; Socket: No; SMD: Yes; Manufacturer1 Example: YAGEO PHYCOMP; Manufacturer1 ComponentHeight: 0.4mm; HelpURL: \\cern.ch\dfs\Applications\Altium\Datasheets\R0402_Phycomp_RC0402.pdf; Author: CERN DEM JLC; CreateDate: 03.12.2007; LatestRevisionDate: 17.10.2012
R66 = R0402_30K_1%_0.0625W_100PPM: as R42 on sheet AFE_ADC; Part Number: R0402_30K_1%_0.0625W_100PPM; Component Kind: Standard; Component Type: Standard; Pin Count: 2; Value: 30k; Status: Not Recommended; Power: 0.0625W; Manufacturer Part Number: R0402_30K_1%_0.0625W_100PPM; Case: 0402; Mounted: Yes; Sense: No; Socket: No; SMD: Yes; Manufacturer1 Example: YAGEO PHYCOMP; Manufacturer1 ComponentHeight: 0.4mm; HelpURL: \\cern.ch\dfs\Applications\Altium\Datasheets\R0402_Phycomp_RC0402.pdf; Author: CERN DEM JLC; CreateDate: 03.12.2007; LatestRevisionDate: 17.10.2012
R67 = R0402_10k_1%_0.0625W_100PPM: Resistor - 1%; Part Description: General Purpose Thick Film Chip Resistor; Manufacturer: GENERIC; Manufacturer1 Part Number: 232270671003L; TC: ±100ppm/°C; PressFit: No; Part Number: R0402_10K_1%_0.0625W_100PPM; Component Kind: Standard; Component Type: Standard; Pin Count: 2; Value: 10k; Status: Not Recommended; Power: 0.0625W; Tolerance: ±1%; Manufacturer Part Number: R0402_10K_1%_0.0625W_100PPM; Case: 0402; Mounted: Yes; Sense: No; Socket: No; SMD: Yes; Manufacturer1 Example: YAGEO PHYCOMP; Manufacturer1 ComponentHeight: 0.4mm; HelpURL: \\cern.ch\dfs\Applications\Altium\Datasheets\R0402_Phycomp_RC0402.pdf; Author: CERN DEM JLC; CreateDate: 03.12.2007; LatestRevisionDate: 17.10.2012

## Nets that join several sheets
GND: Shuttler_AFE (27 pins), U_SAS_Connectors0 (18 pins), U_SAS_Connectors1 (18 pins), U_Shuttler_AFE_Channel0 (14 pins), AFE_CTRL_Logic (32 pins), U_Shuttler_AFE_Channel1 (14 pins), U_Shuttler_AFE_Channel2 (14 pins), U_Shuttler_AFE_Channel3 (14 pins), U_Shuttler_AFE_Channel4 (14 pins), U_Shuttler_AFE_Channel5 (14 pins), U_Shuttler_AFE_Channel6 (14 pins), U_Shuttler_AFE_Channel7 (14 pins), AFE_ADC (33 pins), AFE_Supply (38 pins)
N13V0A: Shuttler_AFE (R44.1), U_Shuttler_AFE_Channel0 (L2A.2), U_Shuttler_AFE_Channel1 (L2B.2), U_Shuttler_AFE_Channel2 (L2C.2), U_Shuttler_AFE_Channel3 (L2D.2), U_Shuttler_AFE_Channel4 (L2E.2), U_Shuttler_AFE_Channel5 (L2F.2), U_Shuttler_AFE_Channel6 (L2G.2), U_Shuttler_AFE_Channel7 (L2H.2), AFE_Supply (8 pins)
P3V3: AFE_CTRL_Logic (12 pins), AFE_Supply (C50.2 IC13.1 R65.2)
P3V3A: Shuttler_AFE (R6.1), AFE_ADC (8 pins)
P5V0: Shuttler_AFE (R14.1), U_Shuttler_AFE_Channel0 (6 pins), U_Shuttler_AFE_Channel1 (6 pins), U_Shuttler_AFE_Channel2 (6 pins), U_Shuttler_AFE_Channel3 (6 pins), U_Shuttler_AFE_Channel4 (6 pins), U_Shuttler_AFE_Channel5 (6 pins), U_Shuttler_AFE_Channel6 (6 pins), U_Shuttler_AFE_Channel7 (6 pins), AFE_Supply (6 pins)
P13V0A: Shuttler_AFE (R43.1), U_Shuttler_AFE_Channel0 (L1A.2), U_Shuttler_AFE_Channel1 (L1B.2), U_Shuttler_AFE_Channel2 (L1C.2), U_Shuttler_AFE_Channel3 (L1D.2), U_Shuttler_AFE_Channel4 (L1E.2), U_Shuttler_AFE_Channel5 (L1F.2), U_Shuttler_AFE_Channel6 (L1G.2), U_Shuttler_AFE_Channel7 (L1H.2), AFE_ADC (C14.1 IC10.2), AFE_Supply (7 pins)
P15V0: AFE_ADC (R40.1 R56.1), AFE_Supply (C38.2 C39.1 L3.2 L5.1)
ADC_CH0: U_Shuttler_AFE_Channel0 (5 pins), AFE_ADC (IC9.2)
ADC_CH1: U_Shuttler_AFE_Channel0 (5 pins), AFE_ADC (IC9.3)
ADC_CH2: U_Shuttler_AFE_Channel1 (5 pins), AFE_ADC (IC9.4)
ADC_CH3: U_Shuttler_AFE_Channel1 (5 pins), AFE_ADC (IC9.5)
ADC_CH4: U_Shuttler_AFE_Channel2 (5 pins), AFE_ADC (IC9.26)
ADC_CH5: U_Shuttler_AFE_Channel2 (5 pins), AFE_ADC (IC9.27)
ADC_CH6: U_Shuttler_AFE_Channel3 (5 pins), AFE_ADC (IC9.28)
ADC_CH7: U_Shuttler_AFE_Channel3 (5 pins), AFE_ADC (IC9.29)
ADC_CH8: U_Shuttler_AFE_Channel4 (5 pins), AFE_ADC (IC9.30)
ADC_CH9: U_Shuttler_AFE_Channel4 (5 pins), AFE_ADC (IC9.31)
ADC_CH10: U_Shuttler_AFE_Channel5 (5 pins), AFE_ADC (IC9.32)
ADC_CH11: U_Shuttler_AFE_Channel5 (5 pins), AFE_ADC (IC9.33)
ADC_CH12: U_Shuttler_AFE_Channel6 (5 pins), AFE_ADC (IC9.34)
ADC_CH13: U_Shuttler_AFE_Channel6 (5 pins), AFE_ADC (IC9.35)
ADC_CH14: U_Shuttler_AFE_Channel7 (5 pins), AFE_ADC (IC9.36)
ADC_CH15: U_Shuttler_AFE_Channel7 (5 pins), AFE_ADC (IC9.37)
AFE0_CTRL_0: U_SAS_Connectors0 (J2A.B8), AFE_CTRL_Logic (C24.2 IC4.12 IC5#1.12)
AFE0_CTRL_1: U_SAS_Connectors0 (J2A.A8), AFE_CTRL_Logic (5 pins)
AFE0_CTRL_2: U_SAS_Connectors0 (J2A.B9), AFE_CTRL_Logic (C11.2 IC5#1.14 IC6#2.14)
AFE0_CTRL_3: U_SAS_Connectors0 (J2A.A9), AFE_CTRL_Logic (C27.2 IC6#2.12 IC8#2.12)
AFE0_CTRL_4: U_SAS_Connectors0 (J2A.B10), AFE_CTRL_Logic (R27#1.1)
AFE0_CTRL_5: U_SAS_Connectors0 (J2A.A10), AFE_CTRL_Logic (R53.1)
AFE0_CTRL_8: U_SAS_Connectors1 (J2B.B8), AFE_ADC (C31.2 IC9.16)
AFE0_CTRL_9: U_SAS_Connectors1 (J2B.A8), AFE_ADC (C30.2 IC9.15)
AFE0_CTRL_10: U_SAS_Connectors1 (J2B.B9), AFE_ADC (C29.2 IC9.17)
AFE0_CTRL_11: U_SAS_Connectors1 (J2B.A9), AFE_ADC (R35.2)
AFE0_CTRL_12: U_SAS_Connectors1 (J2B.B10), AFE_ADC (R31#2.2)
AFE0_CTRL_13: U_SAS_Connectors1 (J2B.A10), AFE_ADC (R36.2)
AOUT0_N: U_SAS_Connectors0 (J2A.B3), U_Shuttler_AFE_Channel0 (C34A.2 IC1A.3)
AOUT0_N: U_SAS_Connectors1 (J2B.B3), U_Shuttler_AFE_Channel4 (C34E.2 IC1E.3)
AOUT0_P: U_SAS_Connectors0 (J2A.B2), U_Shuttler_AFE_Channel0 (C35A.1 IC1A.5)
AOUT0_P: U_SAS_Connectors1 (J2B.B2), U_Shuttler_AFE_Channel4 (C35E.1 IC1E.5)
AOUT1_N: U_SAS_Connectors0 (J2A.A3), U_Shuttler_AFE_Channel0 (C57A.2 IC2A.3)
AOUT1_N: U_SAS_Connectors1 (J2B.A3), U_Shuttler_AFE_Channel4 (C57E.2 IC2E.3)
AOUT1_P: U_SAS_Connectors0 (J2A.A2), U_Shuttler_AFE_Channel0 (C58A.1 IC2A.5)
AOUT1_P: U_SAS_Connectors1 (J2B.A2), U_Shuttler_AFE_Channel4 (C58E.1 IC2E.5)
AOUT2_N: U_SAS_Connectors0 (J2A.B6), U_Shuttler_AFE_Channel1 (C34B.2 IC1B.3)
AOUT2_N: U_SAS_Connectors1 (J2B.B6), U_Shuttler_AFE_Channel5 (C34F.2 IC1F.3)
AOUT2_P: U_SAS_Connectors0 (J2A.B5), U_Shuttler_AFE_Channel1 (C35B.1 IC1B.5)
AOUT2_P: U_SAS_Connectors1 (J2B.B5), U_Shuttler_AFE_Channel5 (C35F.1 IC1F.5)
AOUT3_N: U_SAS_Connectors0 (J2A.A6), U_Shuttler_AFE_Channel1 (C57B.2 IC2B.3)
AOUT3_N: U_SAS_Connectors1 (J2B.A6), U_Shuttler_AFE_Channel5 (C57F.2 IC2F.3)
AOUT3_P: U_SAS_Connectors0 (J2A.A5), U_Shuttler_AFE_Channel1 (C58B.1 IC2B.5)
AOUT3_P: U_SAS_Connectors1 (J2B.A5), U_Shuttler_AFE_Channel5 (C58F.1 IC2F.5)
AOUT4_N: U_SAS_Connectors0 (J2A.B14), U_Shuttler_AFE_Channel2 (C34C.2 IC1C.3)
AOUT4_N: U_SAS_Connectors1 (J2B.B14), U_Shuttler_AFE_Channel6 (C34G.2 IC1G.3)
AOUT4_P: U_SAS_Connectors0 (J2A.B13), U_Shuttler_AFE_Channel2 (C35C.1 IC1C.5)
AOUT4_P: U_SAS_Connectors1 (J2B.B13), U_Shuttler_AFE_Channel6 (C35G.1 IC1G.5)
AOUT5_N: U_SAS_Connectors0 (J2A.A14), U_Shuttler_AFE_Channel2 (C57C.2 IC2C.3)
AOUT5_N: U_SAS_Connectors1 (J2B.A14), U_Shuttler_AFE_Channel6 (C57G.2 IC2G.3)
AOUT5_P: U_SAS_Connectors0 (J2A.A13), U_Shuttler_AFE_Channel2 (C58C.1 IC2C.5)
AOUT5_P: U_SAS_Connectors1 (J2B.A13), U_Shuttler_AFE_Channel6 (C58G.1 IC2G.5)
AOUT6_N: U_SAS_Connectors0 (J2A.B17), U_Shuttler_AFE_Channel3 (C34D.2 IC1D.3)
AOUT6_N: U_SAS_Connectors1 (J2B.B17), U_Shuttler_AFE_Channel7 (C34H.2 IC1H.3)
AOUT6_P: U_SAS_Connectors0 (J2A.B16), U_Shuttler_AFE_Channel3 (C35D.1 IC1D.5)
AOUT6_P: U_SAS_Connectors1 (J2B.B16), U_Shuttler_AFE_Channel7 (C35H.1 IC1H.5)
AOUT7_N: U_SAS_Connectors0 (J2A.A17), U_Shuttler_AFE_Channel3 (C57D.2 IC2D.3)
AOUT7_N: U_SAS_Connectors1 (J2B.A17), U_Shuttler_AFE_Channel7 (C57H.2 IC2H.3)
AOUT7_P: U_SAS_Connectors0 (J2A.A16), U_Shuttler_AFE_Channel3 (C58D.1 IC2D.5)
AOUT7_P: U_SAS_Connectors1 (J2B.A16), U_Shuttler_AFE_Channel7 (C58H.1 IC2H.5)
OUT_CH0: Shuttler_AFE (J3.14), U_Shuttler_AFE_Channel0 (C5A.2 R4A.2)
OUT_CH1: Shuttler_AFE (J3.2), U_Shuttler_AFE_Channel0 (C10A.2 R12A.2)
OUT_CH2: Shuttler_AFE (J3.3), U_Shuttler_AFE_Channel1 (C5B.2 R4B.2)
OUT_CH3: Shuttler_AFE (J3.16), U_Shuttler_AFE_Channel1 (C10B.2 R12B.2)
OUT_CH4: Shuttler_AFE (J3.17), U_Shuttler_AFE_Channel2 (C5C.2 R4C.2)
OUT_CH5: Shuttler_AFE (J3.5), U_Shuttler_AFE_Channel2 (C10C.2 R12C.2)
OUT_CH6: Shuttler_AFE (J3.6), U_Shuttler_AFE_Channel3 (C5D.2 R4D.2)
OUT_CH7: Shuttler_AFE (J3.19), U_Shuttler_AFE_Channel3 (C10D.2 R12D.2)
OUT_CH8: Shuttler_AFE (J3.20), U_Shuttler_AFE_Channel4 (C5E.2 R4E.2)
OUT_CH9: Shuttler_AFE (J3.8), U_Shuttler_AFE_Channel4 (C10E.2 R12E.2)
OUT_CH10: Shuttler_AFE (J3.9), U_Shuttler_AFE_Channel5 (C5F.2 R4F.2)
OUT_CH11: Shuttler_AFE (J3.22), U_Shuttler_AFE_Channel5 (C10F.2 R12F.2)
OUT_CH12: Shuttler_AFE (J3.23), U_Shuttler_AFE_Channel6 (C5G.2 R4G.2)
OUT_CH13: Shuttler_AFE (J3.11), U_Shuttler_AFE_Channel6 (C10G.2 R12G.2)
OUT_CH14: Shuttler_AFE (J3.12), U_Shuttler_AFE_Channel7 (C5H.2 R4H.2)
OUT_CH15: Shuttler_AFE (J3.25), U_Shuttler_AFE_Channel7 (C10H.2 R12H.2)
REL_CTRL0: U_Shuttler_AFE_Channel0 (T1A.2), AFE_CTRL_Logic (IC5#1.15)
REL_CTRL1: U_Shuttler_AFE_Channel0 (T1A.5), AFE_CTRL_Logic (IC5#1.1)
REL_CTRL2: AFE_CTRL_Logic (IC5#1.2), U_Shuttler_AFE_Channel1 (T1B.2)
REL_CTRL3: AFE_CTRL_Logic (IC5#1.3), U_Shuttler_AFE_Channel1 (T1B.5)
REL_CTRL4: AFE_CTRL_Logic (IC5#1.4), U_Shuttler_AFE_Channel2 (T1C.2)
REL_CTRL5: AFE_CTRL_Logic (IC5#1.5), U_Shuttler_AFE_Channel2 (T1C.5)
REL_CTRL6: AFE_CTRL_Logic (IC5#1.6), U_Shuttler_AFE_Channel3 (T1D.2)
REL_CTRL7: AFE_CTRL_Logic (IC5#1.7), U_Shuttler_AFE_Channel3 (T1D.5)
REL_CTRL8: AFE_CTRL_Logic (IC4.15), U_Shuttler_AFE_Channel4 (T1E.2)
REL_CTRL9: AFE_CTRL_Logic (IC4.1), U_Shuttler_AFE_Channel4 (T1E.5)
REL_CTRL10: AFE_CTRL_Logic (IC4.2), U_Shuttler_AFE_Channel5 (T1F.2)
REL_CTRL11: AFE_CTRL_Logic (IC4.3), U_Shuttler_AFE_Channel5 (T1F.5)
REL_CTRL12: AFE_CTRL_Logic (IC4.4), U_Shuttler_AFE_Channel6 (T1G.2)
REL_CTRL13: AFE_CTRL_Logic (IC4.5), U_Shuttler_AFE_Channel6 (T1G.5)
REL_CTRL14: AFE_CTRL_Logic (IC4.6), U_Shuttler_AFE_Channel7 (T1H.2)
REL_CTRL15: AFE_CTRL_Logic (IC4.7), U_Shuttler_AFE_Channel7 (T1H.5)

## Assembly variants
std: not fitted RL1A RL1B RL1C RL1D RL1E RL1F RL1G RL1H RL2A RL2B RL2C RL2D RL2E RL2F RL2G RL2H